# Altium schematic sheet TMP102.SchDoc
size A4; SheetNumber: 4; SheetTotal: 6
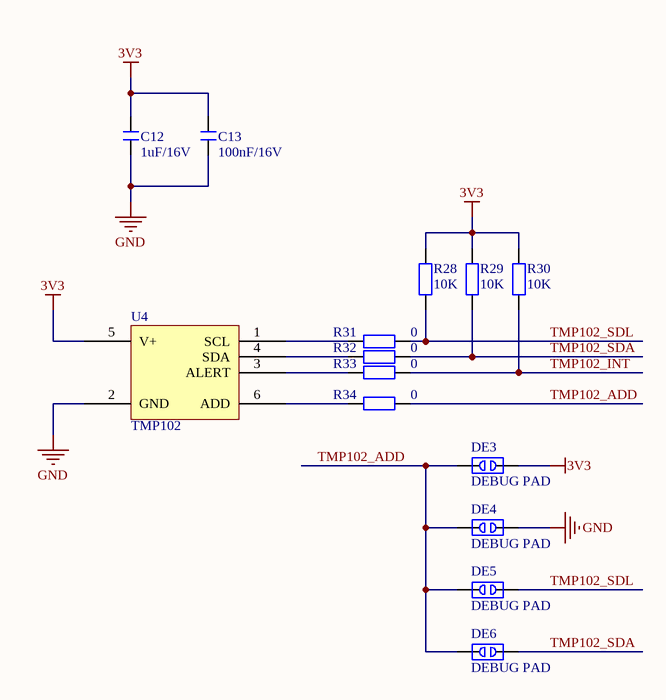
[diagram p0: TMP102.SchDoc]

## Parts
C12  1uF/16V  [C 0402_L]
C13  100nF/16V  [C 0402_L]
DE3  DEBUG PAD  [DEBUG_A]
DE4  DEBUG PAD  [DEBUG_A]
DE5  DEBUG PAD  [DEBUG_A]
DE6  DEBUG PAD  [DEBUG_A]
R28  10K  [R 0402_L]
R29  10K  [R 0402_L]
R30  10K  [R 0402_L]
R31  0  [R 0402_L]
R32  0  [R 0402_L]
R33  0  [R 0402_L]
R34  0  [R 0402_L]
U4  TMP102  [TMP102]

## Nets
3V3: C12.2 C13.1 DE3.2 R28.1 R29.1 R30.1 U4.5(V+)
GND: C12.1 C13.2 DE4.2 U4.2(GND)
TMP102_ADD: DE3.1 DE4.1 DE5.1 DE6.1 R34.1
TMP102_INT: R30.2 R33.1
TMP102_SDA: DE6.2 R29.2 R32.1
TMP102_SDL: DE5.2 R28.2 R31.1
NetR31_2: R31.2 U4.1(SCL)
NetR32_2: R32.2 U4.4(SDA)
NetR33_2: R33.2 U4.3(ALERT)
NetR34_2: R34.2 U4.6(ADD)

## Library data of the parts
C12 = C: 贴片电容; 主类型: 电容; 值精度: ±10%; 元件封装: 0402; 具体类型: 陶瓷电容; 封装类型: 贴片; 温度漂移: X5R; 生产商: SAMSUNG(三星); 生产商零件编码: CL05A105KO5NNNC; 值/型号: 1uF/16V; 立创编号: C29266
C13 = C: 无极性贴片电容; 主类型: 电容; 封装类型: 贴片; 生产商: YAGEO(国巨); 生产商零件编码: CC0402KRX7R7BB104; 值/型号: 100nF/16V; 元件封装: *; 具体类型: *; 温度漂移: *; 温度范围: *; 立创编号: C60474; 类型备注: *; 手册网址: *; 官网地址: *
DE3-DE6 = DEBUG: 调试断点焊盘; 版权归属: 源创客; BOM名称: 调试断点焊盘; 学习资源: www.ooocke.com
R28-R30 = R: 贴片电阻 0402 1%; 主类型: 电阻; 元件封装: 0402; 封装类型: 贴片; 温度漂移: ±100ppm/℃; 生产商: 国巨; 生产商零件编码: RC0402FR-0710KL; 值/型号: 10K; 值精度: ±1%; 具体类型: 贴片电阻; 立创编号: C60490
R31-R34 = R: 贴片电阻; 主类型: 电阻; 元件封装: 0402; 生产商: YAGEO(国巨); 生产商零件编码: RC0402JR-070RL; 值/型号: 0; 立创编号: C60485